# Altium schematic sheet 2_Microcontroler_48.SchDoc
size A4; SheetNumber: 2; SheetTotal: 4
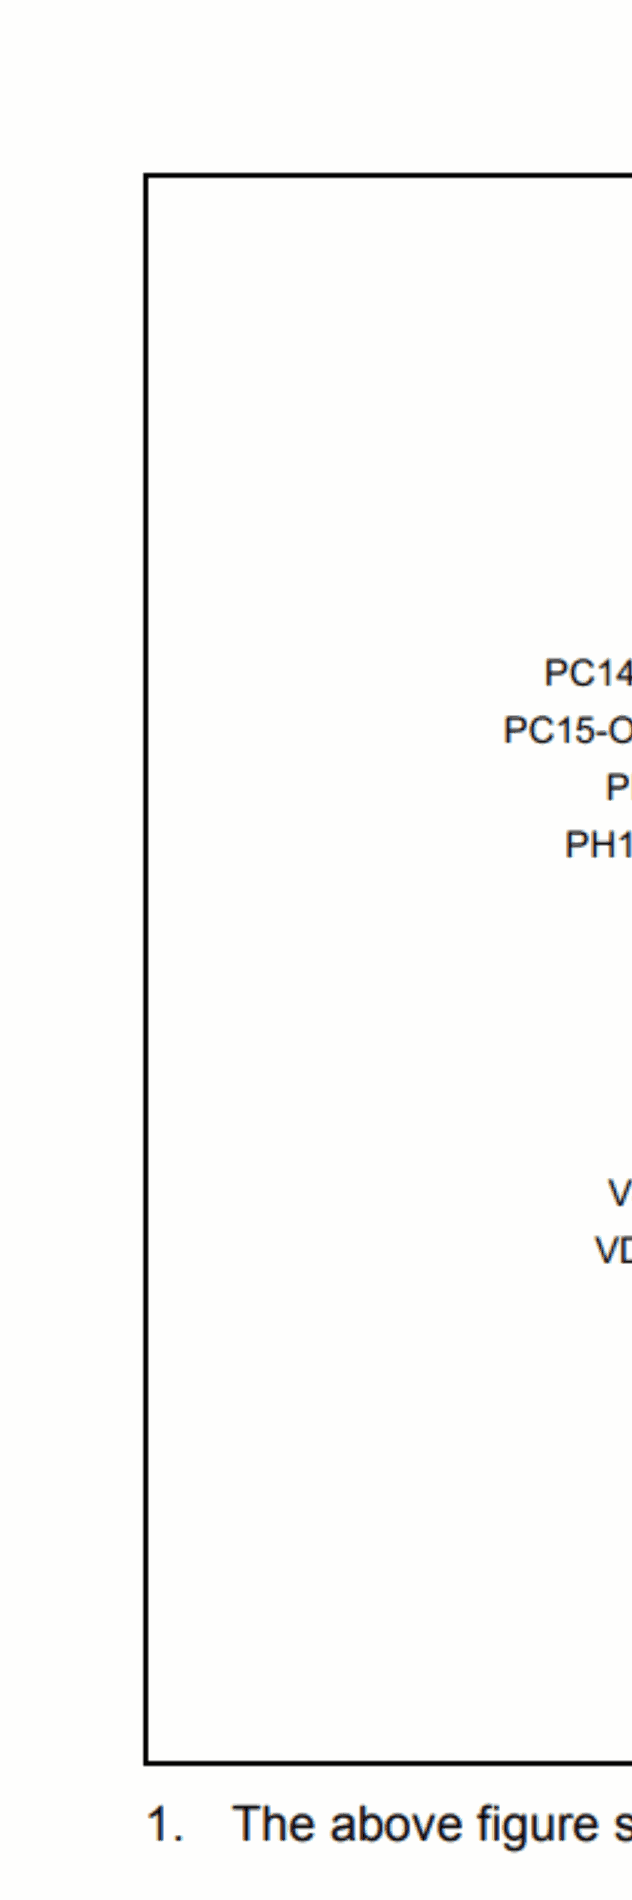
[diagram p0: 2_Microcontroler_48.SchDoc, top left]
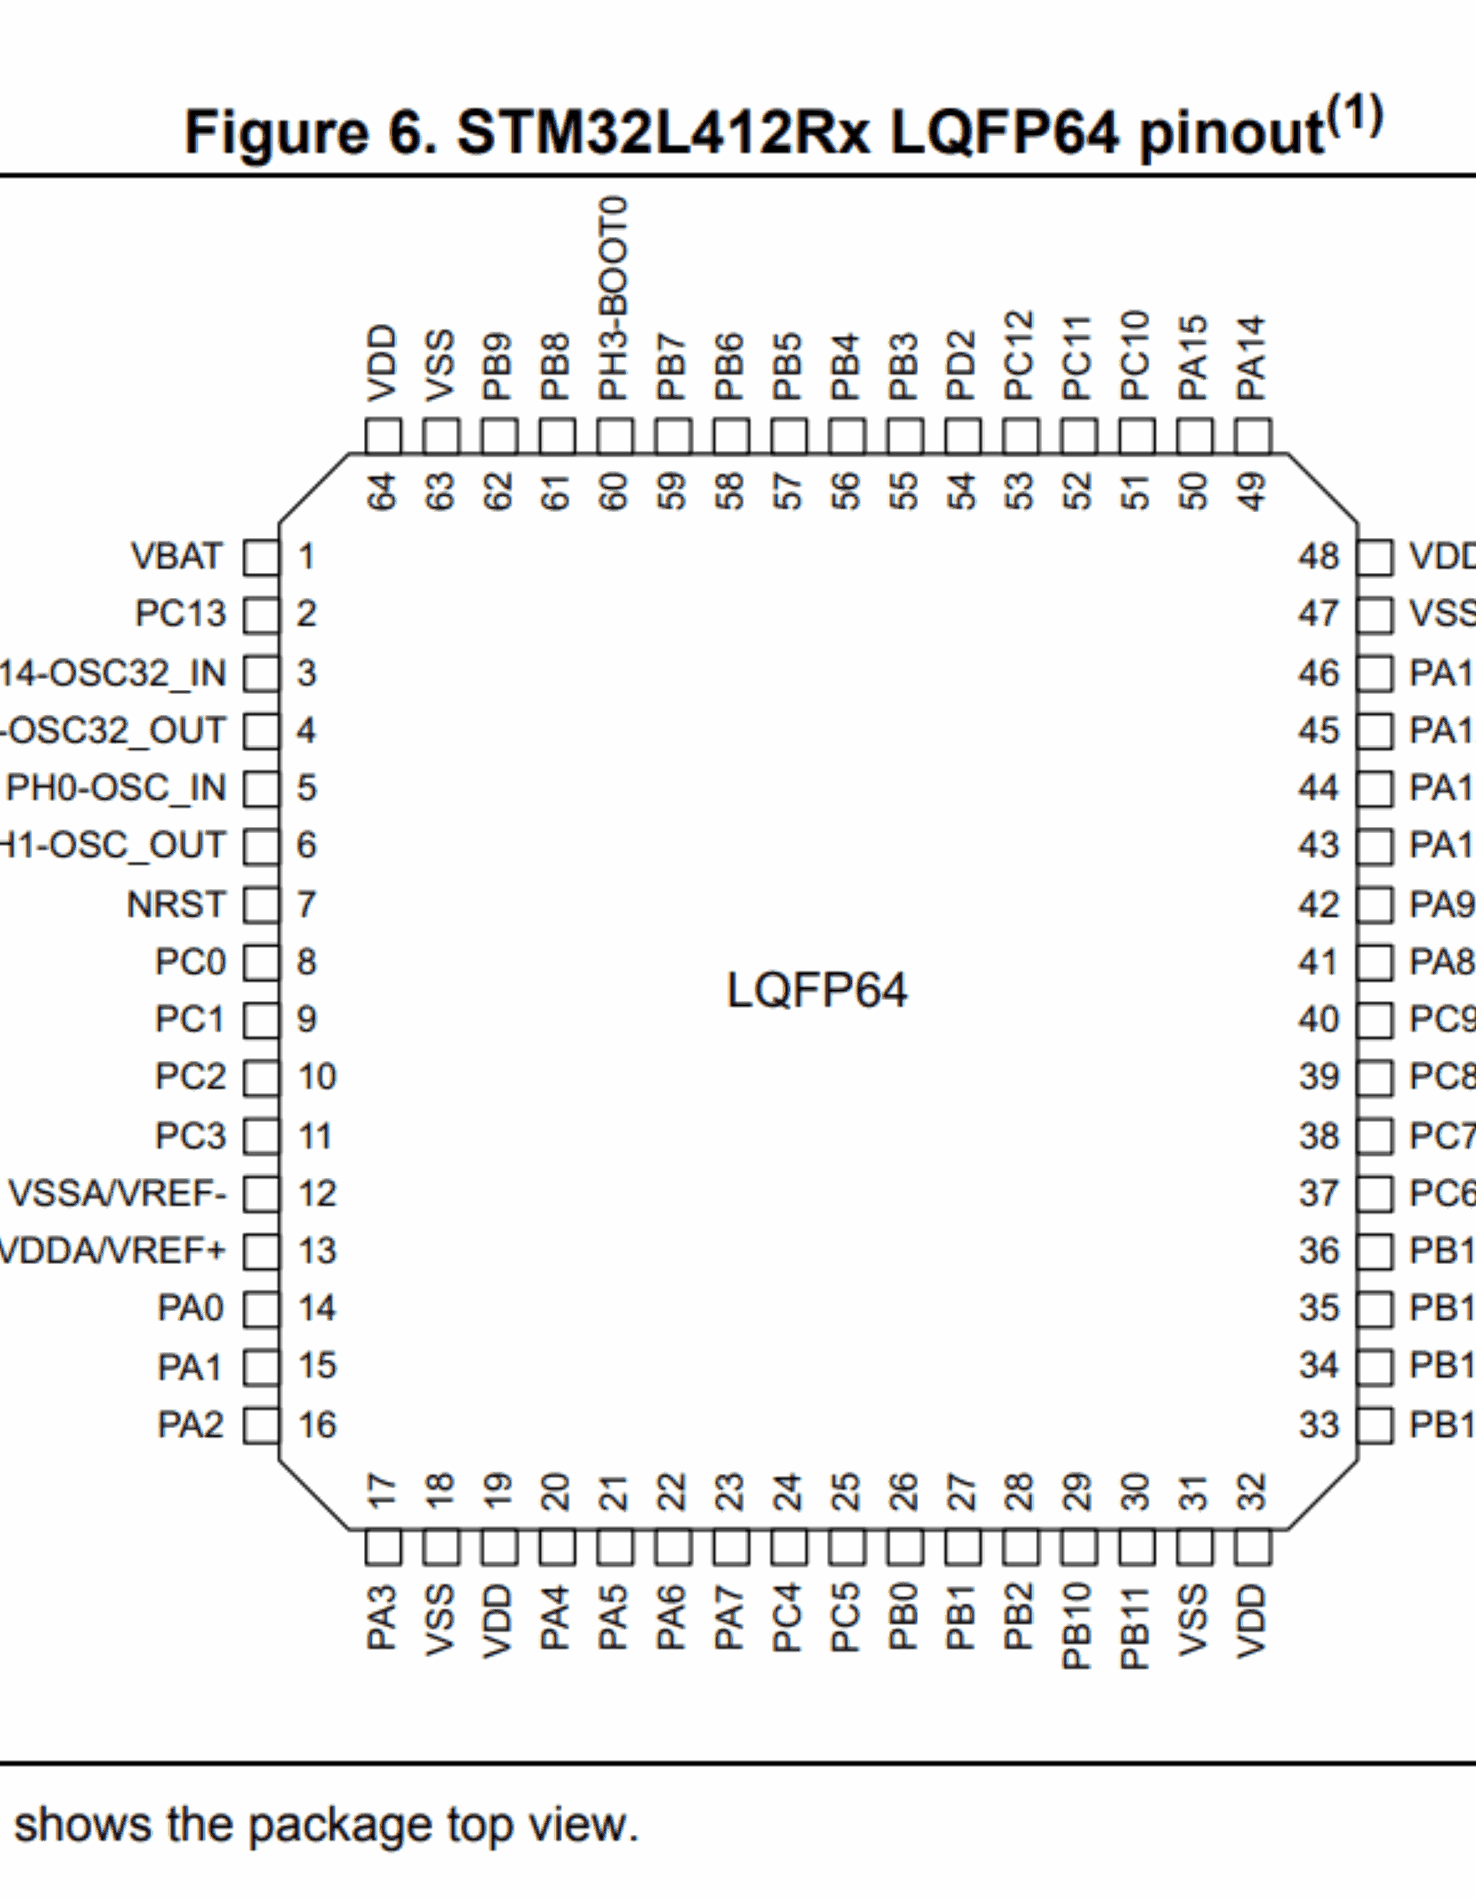
[diagram p1: 2_Microcontroler_48.SchDoc, top middle]
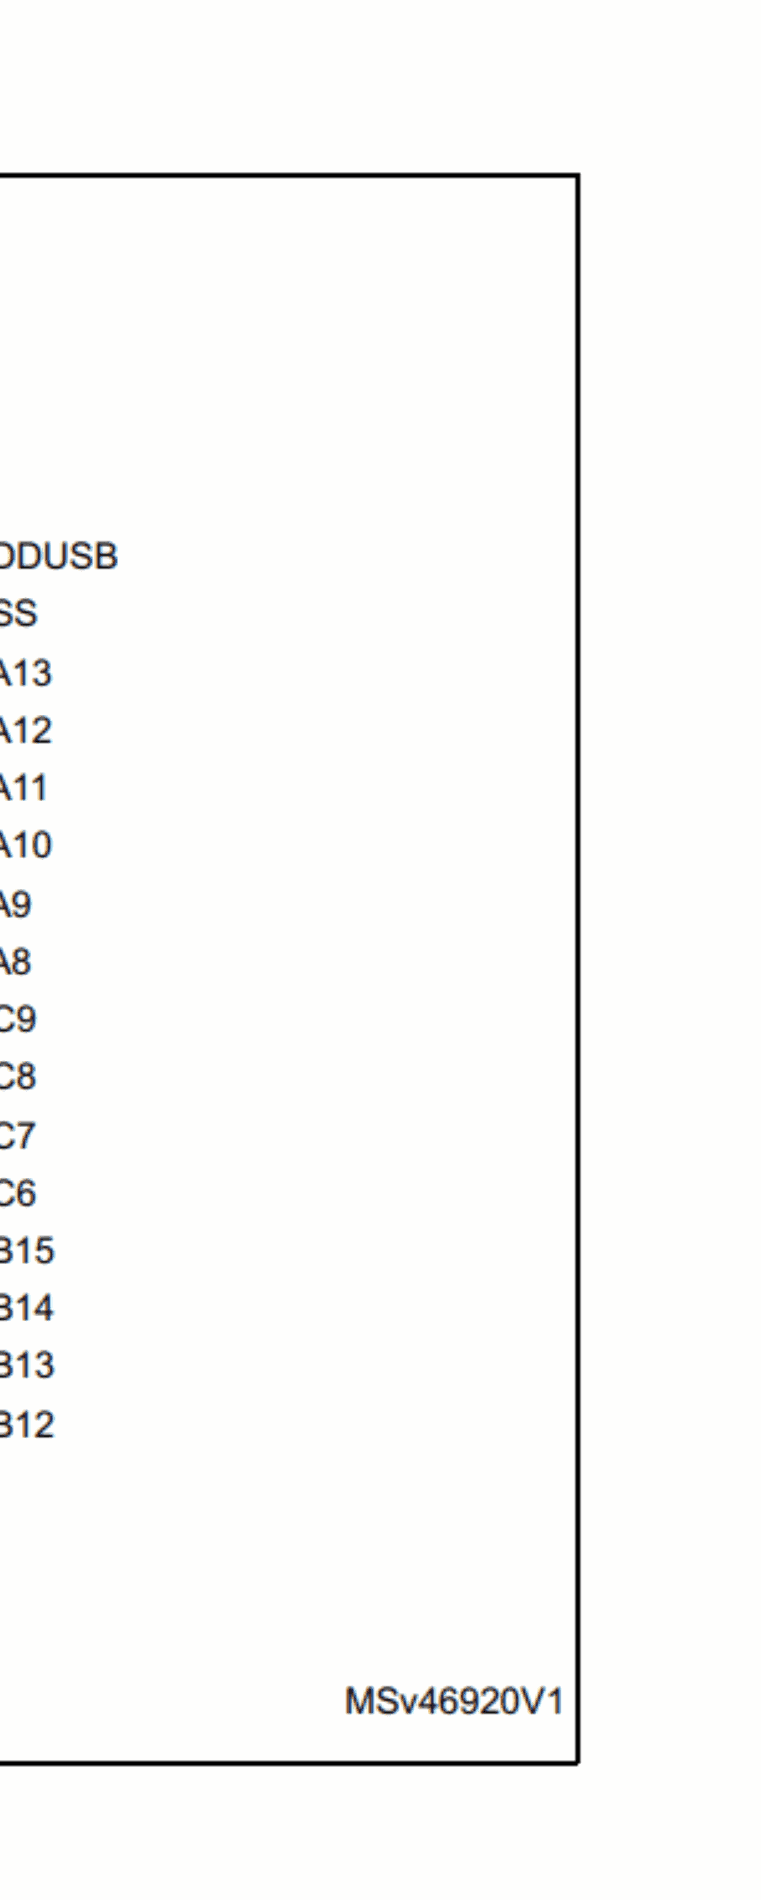
[diagram p2: 2_Microcontroler_48.SchDoc, top right]
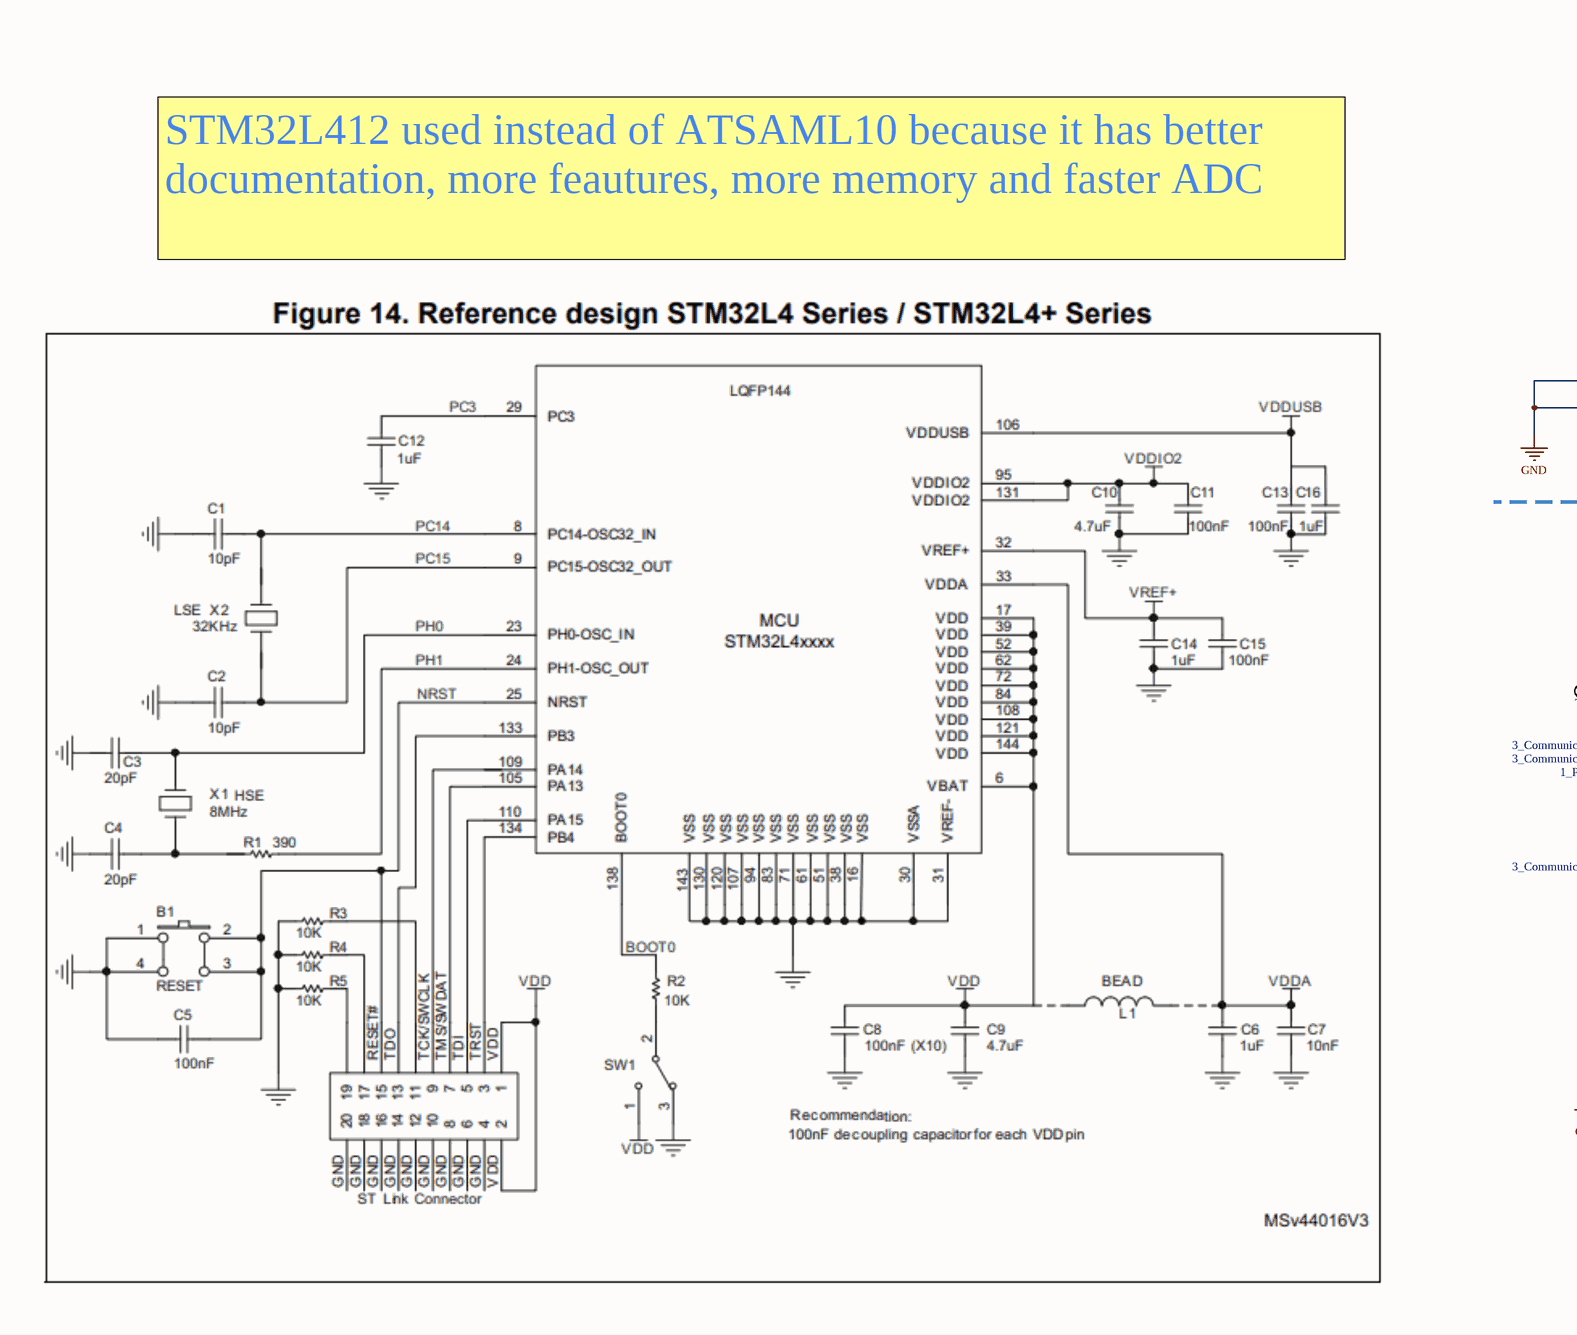
[diagram p3: 2_Microcontroler_48.SchDoc, bottom left]
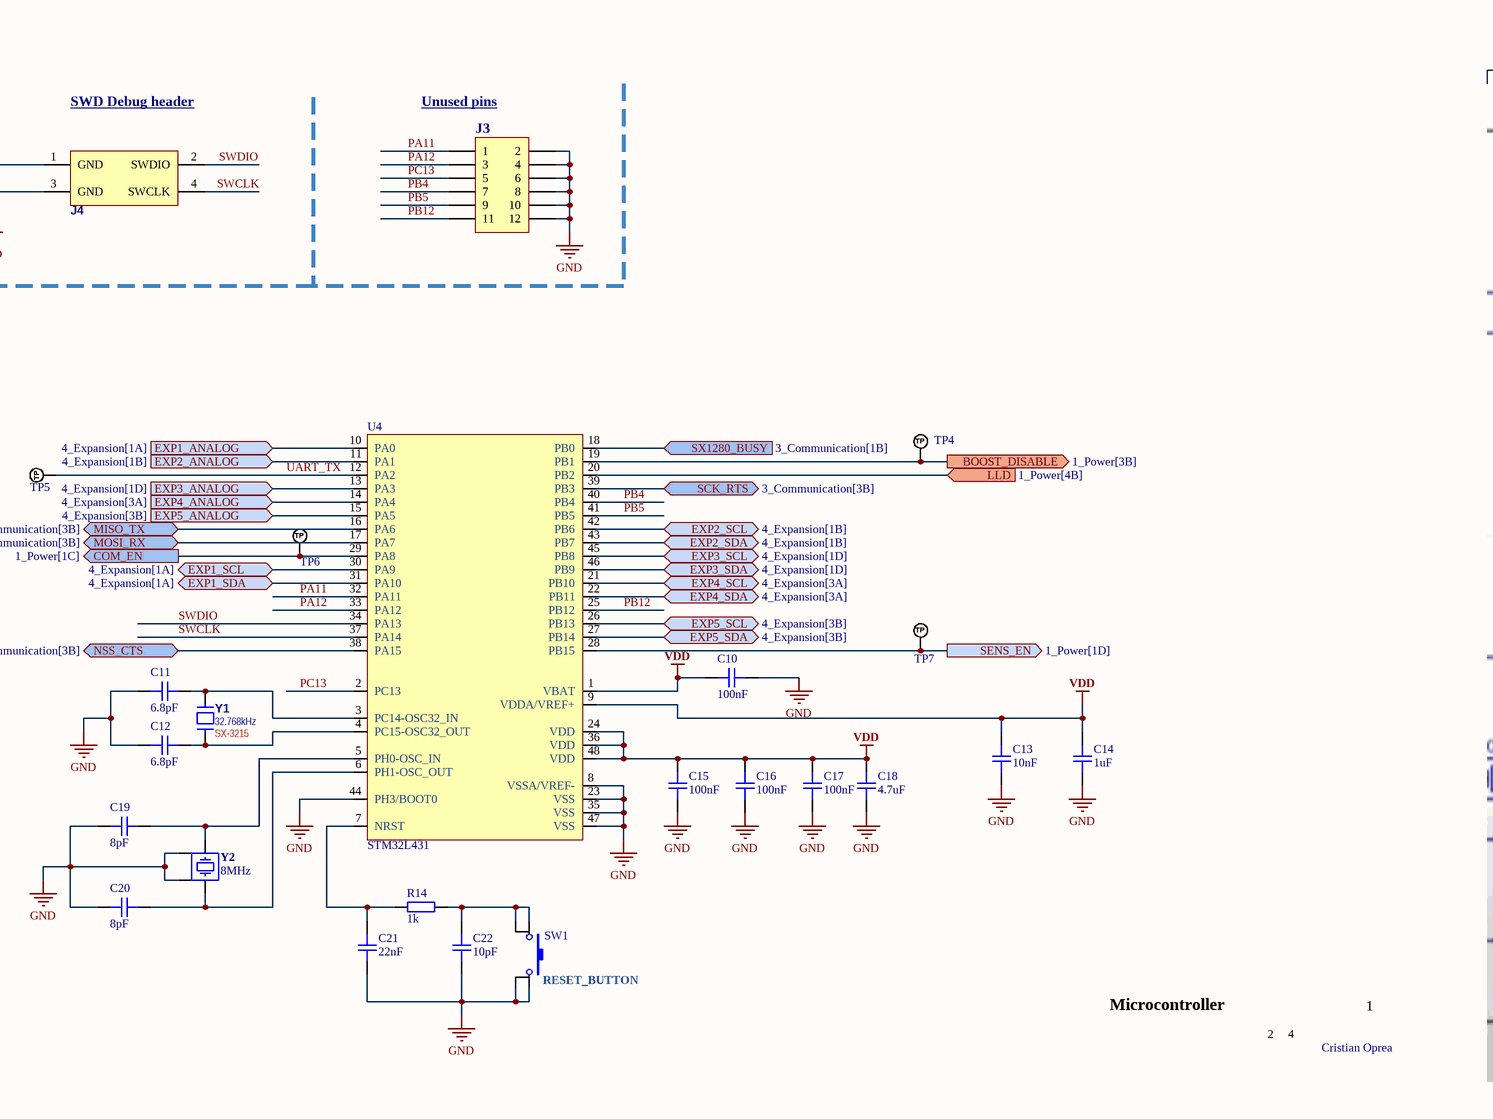
[diagram p4: 2_Microcontroler_48.SchDoc, bottom middle]
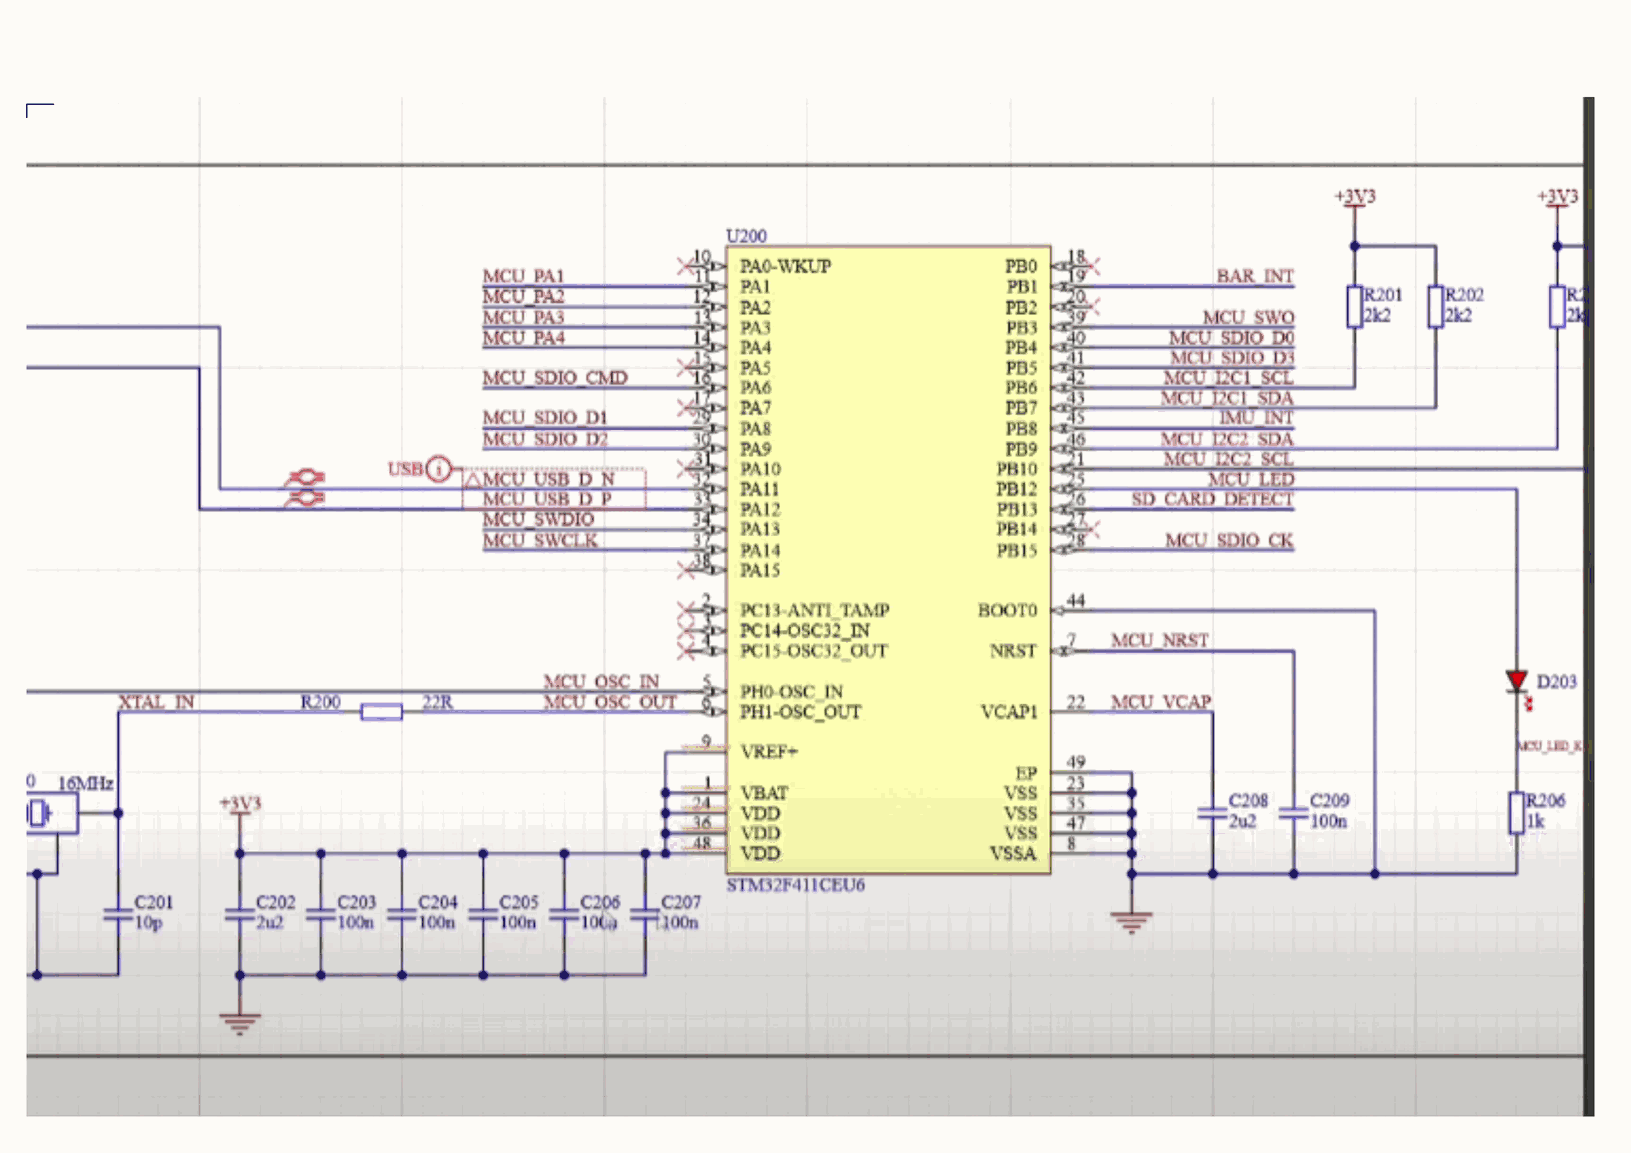
[diagram p5: 2_Microcontroler_48.SchDoc, bottom right]

## Parts
C10  100nF  [C0603]
C11  6.8pF  [C0603]
C12  6.8pF  [C0603]
C13  10nF  [C0603]
C14  1uF  [C0603]
C15  100nF  [C0603]
C16  100nF  [C0603]
C17  100nF  [C0603]
C18  4.7uF  [C0603]
C19  8pF  [C0603]
C20  8pF  [C0603]
C21  22nF  [C0603]
C22  10pF  [C0603]
J3  Header 6X2  [HEADER_6x2_2.54]  (value not drawn)
J4  SWD connector  [HEADER_2x2_2.54]  (value not drawn)
R14  1k  [R0603]
SW1  PTS645SM43SMTR92 LFS  [SW_SKRPACE010]  (value not drawn)
TP4  TP_NOBOM  [TEST_PAD_THD]  (value not drawn)  (no BOM)
TP5  TP_NOBOM  [TEST_PAD_THD]  (value not drawn)  (no BOM)
TP6  TP_NOBOM  [TEST_PAD_THD]  (value not drawn)  (no BOM)
TP7  TP_NOBOM  [TEST_PAD_THD]  (value not drawn)  (no BOM)
U4  STM32L431  [QFPN-48]
Y1  32.768kHz  PackageReference: SX-3215  [CRYSTAL_SX-3215]
Y2  8MHz  [CRYSTAL_ECX-32_3.2x2.5x0.8 - duplicate]

## Ports
BOOST_DISABLE (out, see 1_Power[3B]), COM_EN (out, see 1_Power[1C]), EXP1_ANALOG (in, see 4_Expansion[1A]), EXP1_SCL (bidir, see 4_Expansion[1A]), EXP1_SDA (bidir, see 4_Expansion[1A]), EXP2_ANALOG (in, see 4_Expansion[1B]), EXP2_SCL (bidir, see 4_Expansion[1B]), EXP2_SDA (bidir, see 4_Expansion[1B]), EXP3_ANALOG (in, see 4_Expansion[1D]), EXP3_SCL (bidir, see 4_Expansion[1D]), EXP3_SDA (bidir, see 4_Expansion[1D]), EXP4_ANALOG (in, see 4_Expansion[3A]), EXP4_SCL (bidir, see 4_Expansion[3A]), EXP4_SDA (bidir, see 4_Expansion[3A]), EXP5_ANALOG (in, see 4_Expansion[3B]), EXP5_SCL (bidir, see 4_Expansion[3B]), EXP5_SDA (bidir, see 4_Expansion[3B]), LLD (in, see 1_Power[4B]), MISO_TX (bidir, see 3_Communication[3B]), MOSI_RX (bidir, see 3_Communication[3B]), NSS_CTS (bidir, see 3_Communication[3B]), SCK_RTS (bidir, see 3_Communication[3B]), SENS_EN (out, see 1_Power[1D]), SX1280_BUSY (in, see 3_Communication[1B])

## Nets
GND: C10.1 C11.1 C12.1 C13.1 C14.1 C15.1 C16.1 C17.1 C18.1 C19.1 C20.1 C21.1 C22.1 J3.2 J3.4 J3.6 J3.8 J3.10 J3.12 J4.1(GND) J4.3(GND) SW1.3 SW1.4 U4.8(VSSA/VREF-) U4.23(VSS) U4.35(VSS) U4.44(PH3/BOOT0) U4.47(VSS) Y2.2 Y2.4
VDD: C10.2 C13.2 C14.2 C15.2 C16.2 C17.2 C18.2 U4.1(VBAT) U4.9(VDDA/VREF+) U4.24(VDD) U4.36(VDD) U4.48(VDD)
BOOST_DISABLE: TP4.1(TP) U4.19(PB1) ; port BOOST_DISABLE
COM_EN: TP6.1(TP) U4.29(PA8) ; port COM_EN
EXP1_ANALOG: U4.10(PA0) ; port EXP1_ANALOG
EXP1_SCL: U4.30(PA9) ; port EXP1_SCL
EXP1_SDA: U4.31(PA10) ; port EXP1_SDA
EXP2_ANALOG: U4.11(PA1) ; port EXP2_ANALOG
EXP2_SCL: U4.42(PB6) ; port EXP2_SCL
EXP2_SDA: U4.43(PB7) ; port EXP2_SDA
EXP3_ANALOG: U4.13(PA3) ; port EXP3_ANALOG
EXP3_SCL: U4.45(PB8) ; port EXP3_SCL
EXP3_SDA: U4.46(PB9) ; port EXP3_SDA
EXP4_ANALOG: U4.14(PA4) ; port EXP4_ANALOG
EXP4_SCL: U4.21(PB10) ; port EXP4_SCL
EXP4_SDA: U4.22(PB11) ; port EXP4_SDA
EXP5_ANALOG: U4.15(PA5) ; port EXP5_ANALOG
EXP5_SCL: U4.26(PB13) ; port EXP5_SCL
EXP5_SDA: U4.27(PB14) ; port EXP5_SDA
LLD: U4.20(PB2) ; port LLD
MISO_TX: U4.16(PA6) ; port MISO_TX
MOSI_RX: U4.17(PA7) ; port MOSI_RX
NSS_CTS: U4.38(PA15) ; port NSS_CTS
PA11: J3.1 U4.32(PA11)
PA12: J3.3 U4.33(PA12)
PB4: J3.7 U4.40(PB4)
PB5: J3.9 U4.41(PB5)
PB12: J3.11 U4.25(PB12)
PC13: J3.5 U4.2(PC13)
SCK_RTS: U4.39(PB3) ; port SCK_RTS
SENS_EN: TP7.1(TP) U4.28(PB15) ; port SENS_EN
SWCLK: J4.4(SWCLK) U4.37(PA14)
SWDIO: J4.2(SWDIO) U4.34(PA13)
SX1280_BUSY: U4.18(PB0) ; port SX1280_BUSY
UART_TX: TP5.1(TP) U4.12(PA2)
NetC11_2: C11.2 U4.3(PC14-OSC32_IN) Y1.2
NetC12_2: C12.2 U4.4(PC15-OSC32_OUT) Y1.1
NetC19_2: C19.2 U4.5(PH0-OSC_IN) Y2.3
NetC20_2: C20.2 U4.6(PH1-OSC_OUT) Y2.1
NetC21_2: C21.2 R14.1 U4.7(NRST)
NetC22_2: C22.2 R14.2 SW1.1 SW1.2

## Notes on the sheet
- STM32L412 used instead of ATSAML10 because it has better documentation, more feautures, more memory and faster ADC
- SWD Debug header
- (near J3) Unused pins
- (near SW1) RESET_BUTTON
- Microcontroller
- 2
- 4
- 1
- Cristian Oprea

## Library data of the parts
C10-C22 = CAP_0603: Capacitor SMD 0603; Manufacturer: *; Manufacturer Part Number: *; Distributor Link: *; LCSC: *; Rating: *; Dielectric: *
J3 = Header 6x2: Header, 12-Pin, Dual row; LatestRevisionDate: 17-Jul-2002; LatestRevisionNote: Re-released for DXP Platform.; Publisher: Altium Limited
J4 = SWD connector: Single Wire Debug connector with UART _TX pin; PackageReference: *; Manufacturer Part Number 1: *
R14 = RES_0603: Resistor SMD 0603; Manufacturer: *; Manufacturer Part Number: *; Distributor Link: *; LCSC: *
SW1 = SW-PB: Switch; Published: 24-Mar-1999; LatestRevisionDate: 17-Jul-2002; LatestRevisionNote: Re-released for DXP Platform.; Publisher: Altium Limited; PackageDescription: Switch; 2 Leads; Manufacturer Part Number 1: PTS645SM43SMTR92 LFS; PackageReference: SW-PB
TP4-TP7 = TEST_POINT_RND_1MM: Test Point Round 1mm (NO BOM)
U4 = STM32L431: Ultra-low-power Arm® Cortex®-M4 32-bit MCU+FPU, 100DMIPS, / up to 128KB flash, 40KB SRAM(LQFP48)
Y1 = CRYSTAL_1: Crystal; Manufacturer Part Number 1: *
Y2 = Crystal: Manufacturer: Epson; Manufacturer Part Number: TSX-3225 24.0000MF15X-AC